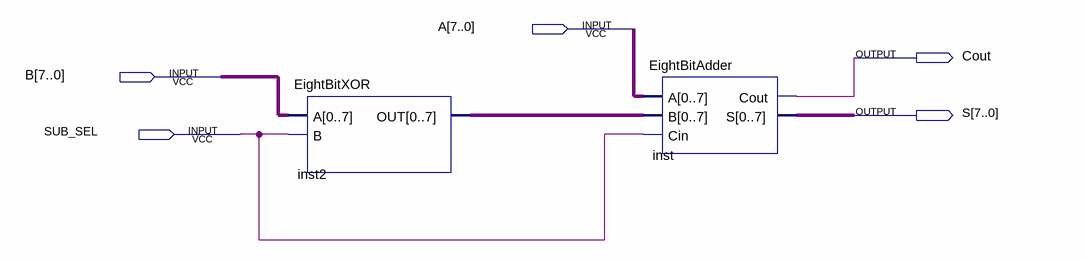
[diagram p0: schematic sheet]
// Quartus schematic Subtractor.bdf as structural Verilog: 2 symbols, 5 pins
module Subtractor (
  input  [7:0] A,
  input  [7:0] B,
  input  SUB_SEL,
  output Cout,
  output [7:0] S
);

  wire [7:0] inst2_out;

  EightBitXOR inst2 (.A(B), .B(SUB_SEL), .OUT(inst2_out));
  EightBitAdder inst (.A(A), .B(inst2_out), .Cin(SUB_SEL), .Cout(Cout), .S(S));
endmodule
